# Altium schematic sheet ADC RC Network.SchDoc: ADC Input Network
size 203 x 127 mm; DrawnBy: Kace Chandler; DocumentNumber: 8; SheetNumber: 8; SheetTotal: 23
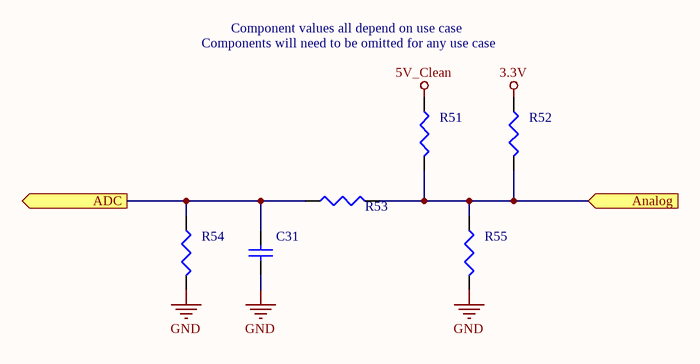
[diagram p0: ADC RC Network.SchDoc]

## Parts
C31  Cap  [0603 to 0805 SMD]  (value not drawn)
R51  Res3  [0603 to 0805 SMD]  (value not drawn)
R52  Res3  [0603 to 0805 SMD]  (value not drawn)
R53  Res3  [0603 to 0805 SMD]  (value not drawn)
R54  Res3  [0603 to 0805 SMD]  (value not drawn)
R55  Res3  [0603 to 0805 SMD]  (value not drawn)

## Ports
ADC (out), Analog (in)

## Nets
3.3V: R52.1
5V_Clean: R51.1
GND: C31.1 R54.2 R55.2
ADC: C31.2 R53.1 R54.1 ; port ADC
Analog: R51.2 R52.2 R53.2 R55.1 ; port Analog

## Notes on the sheet
- Components will need to be omitted for any use case
- Component values all depend on use case

## Library data of the parts
C31 = Cap: Capacitor; Value: Value depends on use case; Published: 8-Jun-2000; LatestRevisionDate: 17-Jul-2002; LatestRevisionNote: Re-released for DXP Platform.; PackageReference: RAD-0.3; Publisher: Altium Limited; PackageDescription: Radial Cap, Thru-Hole; 2 Leads; 0.3 in Pin Spacing
R51-R55 = Res3: Resistor; Value: Value depends on use case; Published: 8-Jun-2000; LatestRevisionDate: 29-May-2009; LatestRevisionNote: IPC-7351 Footprint Added.; PackageReference: J1-0603; Publisher: Altium Limited; PackageDescription: Chip Resistor